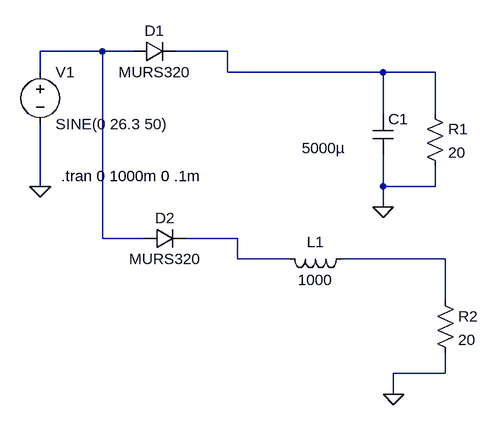
[diagram p0: schematic rectificador_mediaonda2.asc]
rectificador_mediaonda2.asc, the LTspice schematic file:
Version 4
SHEET 1 920 824
WIRE 160 80 64 80
WIRE 208 80 160 80
WIRE 352 80 272 80
WIRE 64 112 64 80
WIRE 352 112 352 80
WIRE 592 112 352 112
WIRE 672 112 592 112
WIRE 592 176 592 112
WIRE 672 176 672 112
WIRE 64 288 64 192
WIRE 592 288 592 240
WIRE 672 288 672 256
WIRE 672 288 592 288
WIRE 592 320 592 288
WIRE 160 368 160 80
WIRE 224 368 160 368
WIRE 368 368 288 368
WIRE 368 400 368 368
WIRE 448 400 368 400
WIRE 688 400 528 400
WIRE 688 464 688 400
WIRE 688 576 688 544
WIRE 688 576 608 576
WIRE 608 608 608 576
FLAG 64 288 0
FLAG 592 320 0
FLAG 608 608 0
SYMBOL voltage 64 96 R0
WINDOW 123 0 0 Left 2
WINDOW 39 0 0 Left 2
SYMATTR InstName V1
SYMATTR Value SINE(0 26.3 50)
SYMBOL cap 576 176 R0
WINDOW 3 -109 53 Left 2
SYMATTR Value 5000µ
SYMATTR InstName C1
SYMBOL res 656 160 R0
SYMATTR InstName R1
SYMATTR Value 20
SYMBOL diode 208 96 R270
WINDOW 0 32 32 VTop 2
WINDOW 3 0 32 VBottom 2
SYMATTR InstName D1
SYMATTR Value MURS320
SYMBOL res 672 448 R0
SYMATTR InstName R2
SYMATTR Value 20
SYMBOL diode 224 384 R270
WINDOW 0 32 32 VTop 2
WINDOW 3 0 32 VBottom 2
SYMATTR InstName D2
SYMATTR Value MURS320
SYMBOL ind 544 384 R90
WINDOW 0 5 56 VBottom 2
WINDOW 3 32 56 VTop 2
SYMATTR InstName L1
SYMATTR Value 1000
TEXT 96 272 Left 2 !.tran 0 1000m 0 .1m

The netlist it stands for:
* rectificador_mediaonda2.asc
V1 N001 0 SINE(0 26.3 50)
C1 N002 0 5000µ
R1 N002 0 20
D1 N001 N002 MURS320
R2 N004 0 20
D2 N001 N003 MURS320
L1 N004 N003 1000
.model D D
.lib standard.dio
.tran 0 1000m 0 .1m
.backanno
.end